# EAGLE design m1-output-reg (EAGLE 9.6.1)
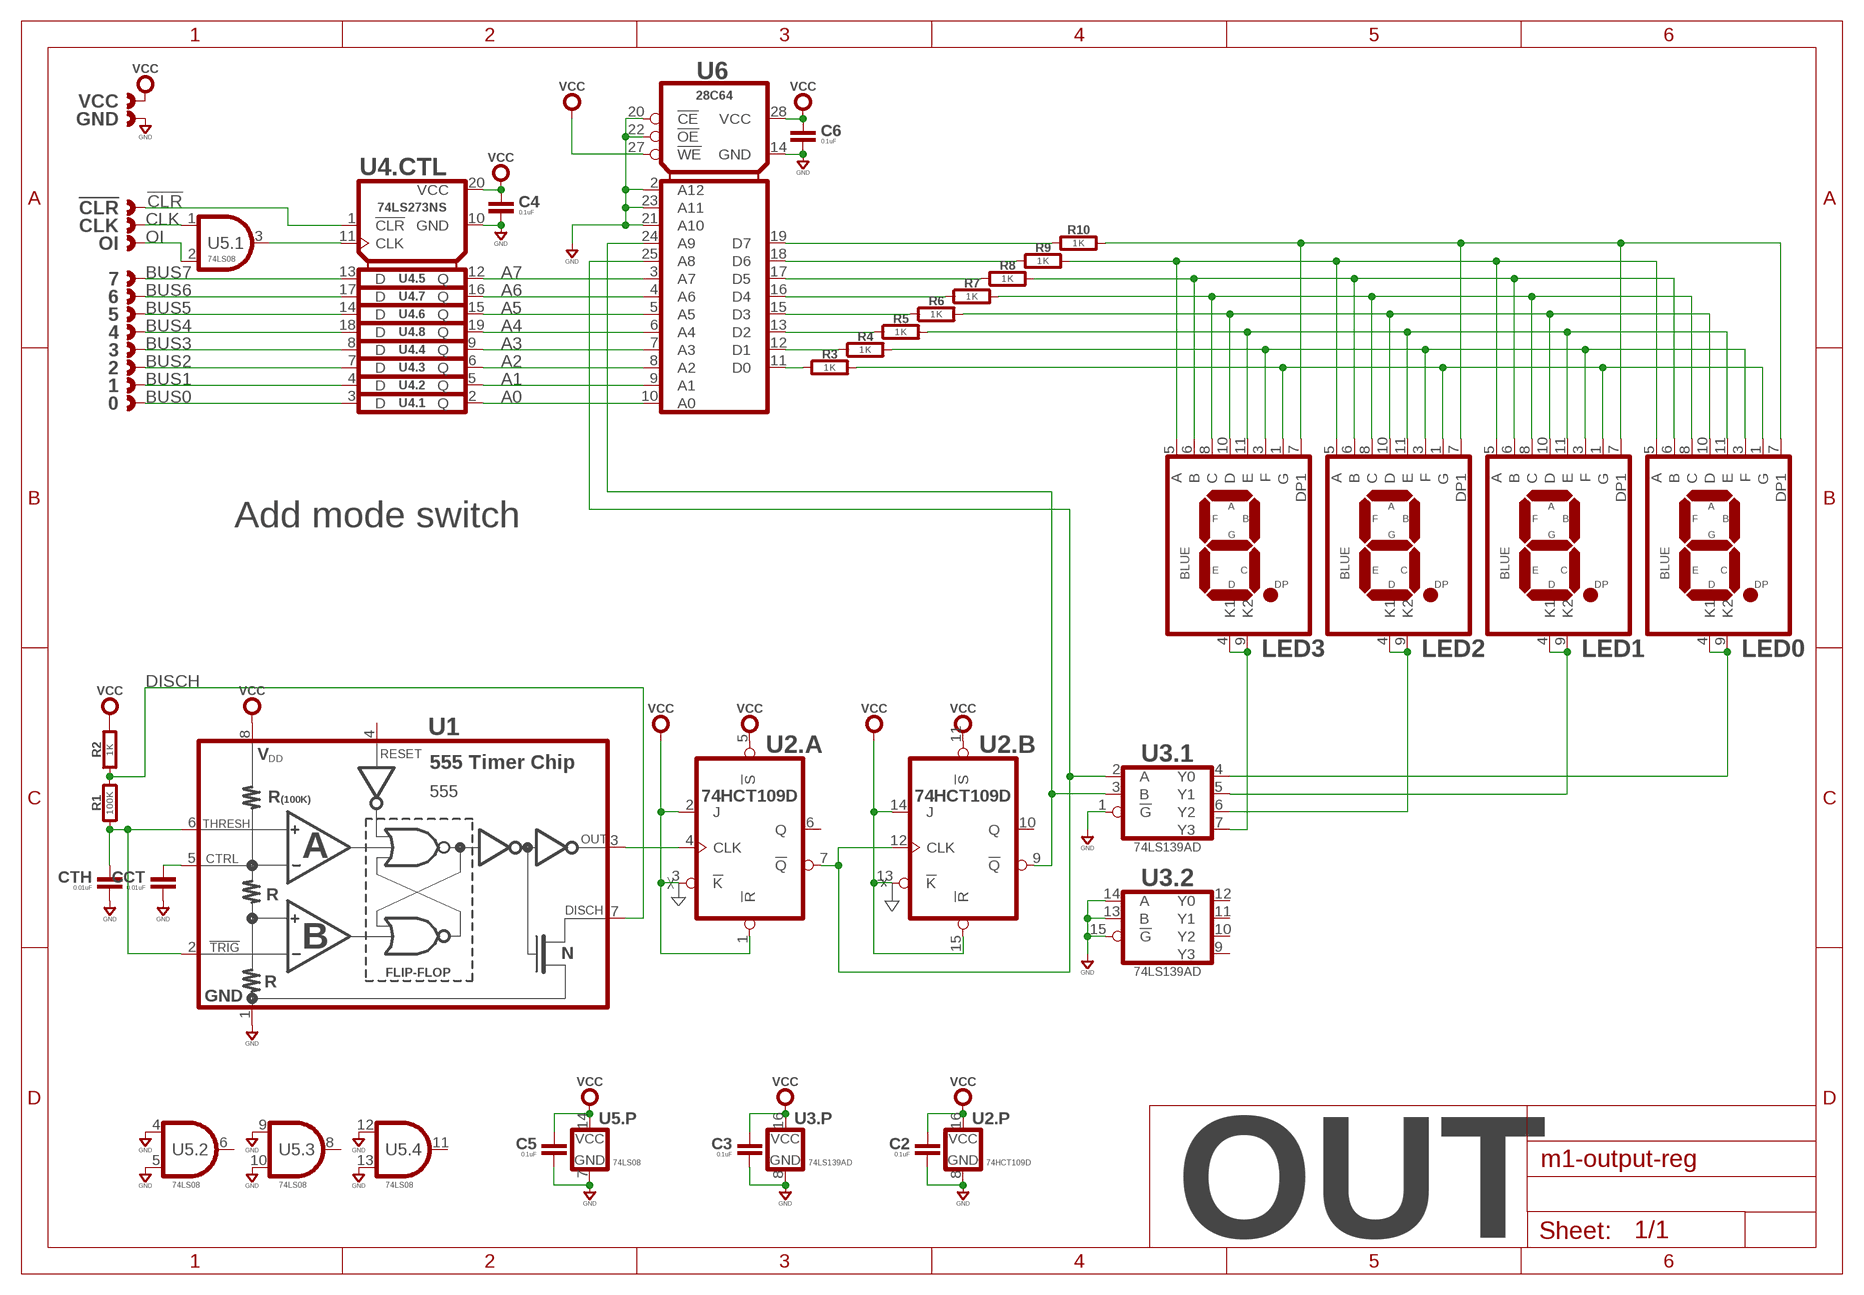
[diagram p0: schematic, sheet 1]

## Parts
0  CAST-01X1  [CAST01-2.54MM]
1  CAST-01X1  [CAST01-2.54MM]
2  CAST-01X1  [CAST01-2.54MM]
3  CAST-01X1  [CAST01-2.54MM]
4  CAST-01X1  [CAST01-2.54MM]
5  CAST-01X1  [CAST01-2.54MM]
6  CAST-01X1  [CAST01-2.54MM]
7  CAST-01X1  [CAST01-2.54MM]
!CLR  CAST-01X1  [CAST01-2.54MM]
C2  0.1uF  CAPACITOR0603  [0603-CAP]
C3  0.1uF  CAPACITOR0603  [0603-CAP]
C4  0.1uF  CAPACITOR0603  [0603-CAP]
C5  0.1uF  CAPACITOR0603  [0603-CAP]
C6  0.1uF  CAPACITOR0603  [0603-CAP]
CCT  0.01uF  CAPACITOR0603  [0603-CAP]
CLK  CAST-01X1  [CAST01-2.54MM]
CTH  0.01uF  CAPACITOR0603  [0603-CAP]
GND  CAST-01X1  [CAST01-2.54MM]
LED0  BLUE  SEVEN_SEG_DISP_DP028-BLUE  [AVAGO-HDSM-281B-7SEG]
LED1  BLUE  SEVEN_SEG_DISP_DP028-BLUE  [AVAGO-HDSM-281B-7SEG]
LED2  BLUE  SEVEN_SEG_DISP_DP028-BLUE  [AVAGO-HDSM-281B-7SEG]
LED3  BLUE  SEVEN_SEG_DISP_DP028-BLUE  [AVAGO-HDSM-281B-7SEG]
OI  CAST-01X1  [CAST01-2.54MM]
R1  100K  RESISTOR0603  [0603-RES]
R2  1K  RESISTOR0603  [0603-RES]
R3  1K  RESISTOR0603  [0603-RES]
R4  1K  RESISTOR0603  [0603-RES]
R5  1K  RESISTOR0603  [0603-RES]
R6  1K  RESISTOR0603  [0603-RES]
R7  1K  RESISTOR0603  [0603-RES]
R8  1K  RESISTOR0603  [0603-RES]
R9  1K  RESISTOR0603  [0603-RES]
R10  1K  RESISTOR0603  [0603-RES]
U1  555  555SOIC  [SOP08]
U2  74HCT109D  74AHCT109D  [SO16]
U3  74LS139AD  74LS139D  [SO16]
U4  74LS273NS  [SO20]
U5  74LS08  74LS08D  [SOP14]
U6  28C64  28C64S  [SO28]
VCC  CAST-01X1  [CAST01-2.54MM]

## Nets
!CLR: !CLR.1 U4.1(.CTL:!CLR)
A0: U4.2(.1:Q) U6.10(A0)
A1: U4.5(.2:Q) U6.9(A1)
A2: U4.6(.3:Q) U6.8(A2)
A3: U4.9(.4:Q) U6.7(A3)
A4: U4.19(.8:Q) U6.6(A4)
A5: U4.15(.6:Q) U6.5(A5)
A6: U4.16(.7:Q) U6.4(A6)
A7: U4.12(.5:Q) U6.3(A7)
BUS0: 0.1 U4.3(.1:D)
BUS1: 1.1 U4.4(.2:D)
BUS2: 2.1 U4.7(.3:D)
BUS3: 3.1 U4.8(.4:D)
BUS4: 4.1 U4.18(.8:D)
BUS5: 5.1 U4.14(.6:D)
BUS6: 6.1 U4.17(.7:D)
BUS7: 7.1 U4.13(.5:D)
CLK: CLK.1 U5.1(.1:A)
DISCH: R1.1 R2.1 U1.7(DISCHARGE)
GND: C2.2 C3.2 C4.2 C5.2 C6.2 CCT.2 CTH.2 GND.1 U1.1(GND) U2.8(.P:GND) U3.1(.1:!G) U3.8(.P:GND) U3.13(.2:B) U3.14(.2:A) U3.15(.2:!G) U4.10(.CTL:GND) U5.4(.2:A) U5.5(.2:B) U5.7(.P:GND) U5.9(.3:A) U5.10(.3:B) U5.12(.4:A) U5.13(.4:B) U6.2(A12) U6.14(GND) U6.20(!CE) U6.21(A10) U6.22(!OE) U6.23(A11)
N$1: CTH.1 R1.2 U1.2(TRIGGER#) U1.6(THRESHOLD)
N$2: CCT.1 U1.5(CONTROL)
N$4: U1.3(OUTPUT) U2.4(.A:CLK)
N$5: U2.9(.B:!Q) U3.3(.1:B) U6.24(A9)
N$6: U2.7(.A:!Q) U2.12(.B:CLK) U3.2(.1:A) U6.25(A8)
N$10: U4.11(.CTL:CLK) U5.3(.1:Y)
N$27: R3.1 U6.11(D0)
N$28: R4.1 U6.12(D1)
N$29: R5.1 U6.13(D2)
N$30: R6.1 U6.15(D3)
N$31: R7.1 U6.16(D4)
N$32: R8.1 U6.17(D5)
N$33: R9.1 U6.18(D6)
N$34: R10.1 U6.19(D7)
N$35: LED0.7(DP1) LED1.7(DP1) LED2.7(DP1) LED3.7(DP1) R10.2
N$36: LED0.5(A) LED1.5(A) LED2.5(A) LED3.5(A) R9.2
N$37: LED0.6(B) LED1.6(B) LED2.6(B) LED3.6(B) R8.2
N$38: LED0.4(K1) LED0.9(K2) U3.4(.1:Y0)
N$39: LED0.8(C) LED1.8(C) LED2.8(C) LED3.8(C) R7.2
N$40: LED0.10(D) LED1.10(D) LED2.10(D) LED3.10(D) R6.2
N$41: LED0.11(E) LED1.11(E) LED2.11(E) LED3.11(E) R5.2
N$42: LED0.3(F) LED1.3(F) LED2.3(F) LED3.3(F) R4.2
N$43: LED0.1(G) LED1.1(G) LED2.1(G) LED3.1(G) R3.2
N$44: LED3.4(K1) LED3.9(K2) U3.7(.1:Y3)
N$45: LED2.4(K1) LED2.9(K2) U3.6(.1:Y2)
N$46: LED1.4(K1) LED1.9(K2) U3.5(.1:Y1)
OI: OI.1 U5.2(.1:B)
VCC: C2.1 C3.1 C4.1 C5.1 C6.1 R2.2 U1.8(VDD) U2.1(.A:!R) U2.2(.A:J) U2.3(.A:!K) U2.5(.A:!S) U2.11(.B:!S) U2.13(.B:!K) U2.14(.B:J) U2.15(.B:!R) U2.16(.P:VCC) U3.16(.P:VCC) U4.20(.CTL:VCC) U5.14(.P:VCC) U6.27(!WE) U6.28(VCC) VCC.1
Unconnected: U1.4(RESET#) U2.6(.A:Q) U2.10(.B:Q) U3.9(.2:Y3) U3.10(.2:Y2) U3.11(.2:Y1) U3.12(.2:Y0) U5.6(.2:Y) U5.8(.3:Y) U5.11(.4:Y)

## Notes on the sheet
- Add mode switch
- OUT

## Library data of the parts
0 1-7 !CLR CLK GND OI VCC = con-headers:CAST-01X1: Castelated Edge Hole Pad
C2-C6 CCT CTH = rlc:CAPACITOR: Capacitor
LED0 LED1-LED3 = led:SEVEN_SEG_DISP_DP: Seven Segment LED Display; MFR: Avago; MPN: HDSM-283B
R1-R10 = rlc:RESISTOR: Resistor
U1 = logic:555: Timer Chip; MFR: TI; MPN: NE555PSR
U2 = logic:74*109?: Dual J-K Flip Flop Pos. Edge; MPN: 74HCT109D
U3 = logic:74*139?: Dual 2-line to 4-line Decoder/Demux; MPN: 74LS139AD
U4 = logic:74*273?: Octal D-type Flip Flop; MPN: 74LS273NS
U5 = logic:74*08?: Quad AND Gate; MPN: 74LS08D
U6 = logic:28*64?: EEPROM 8K x 8; MFR: Microchip; MPN: AT28C64B-15SU

## Board
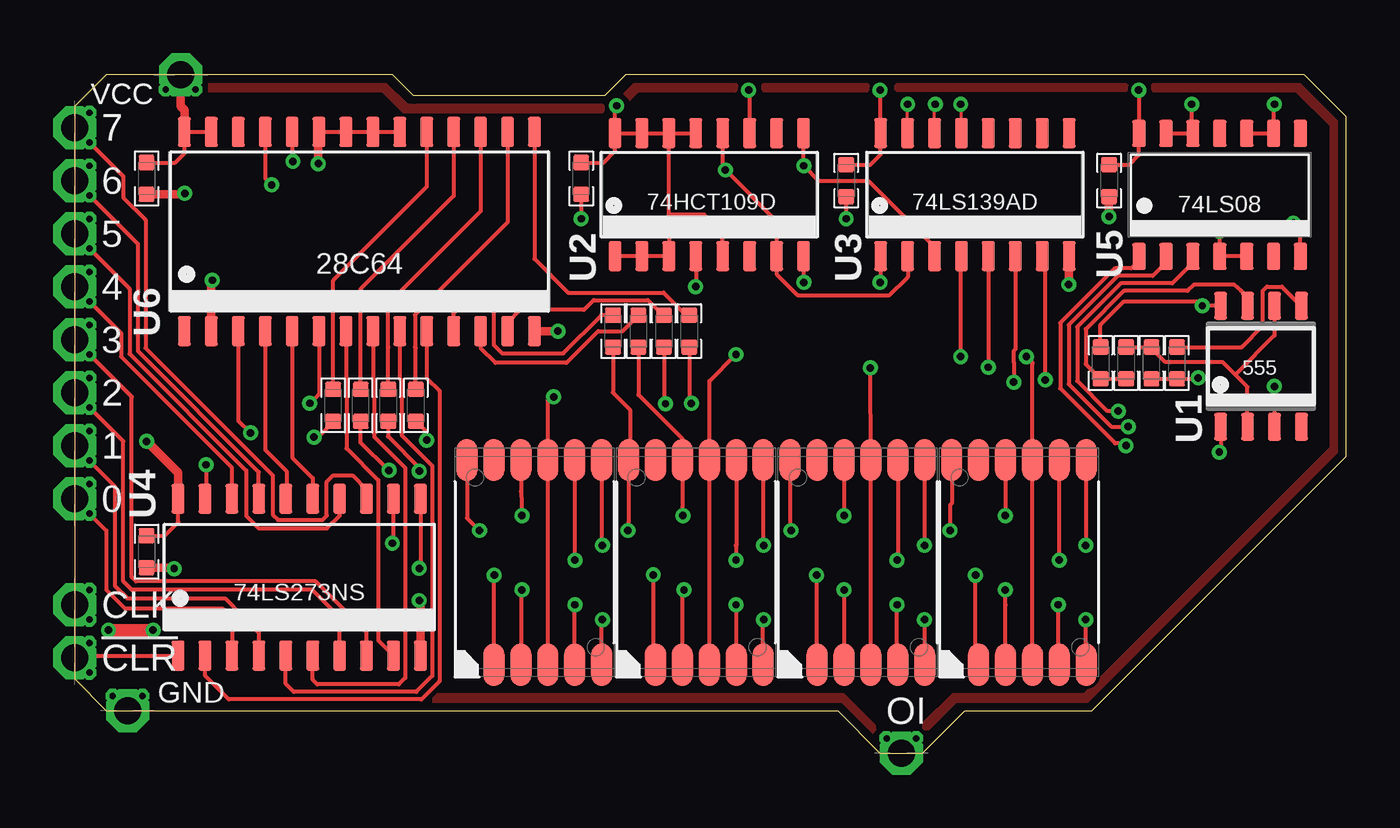
[diagram p1: board, top side]
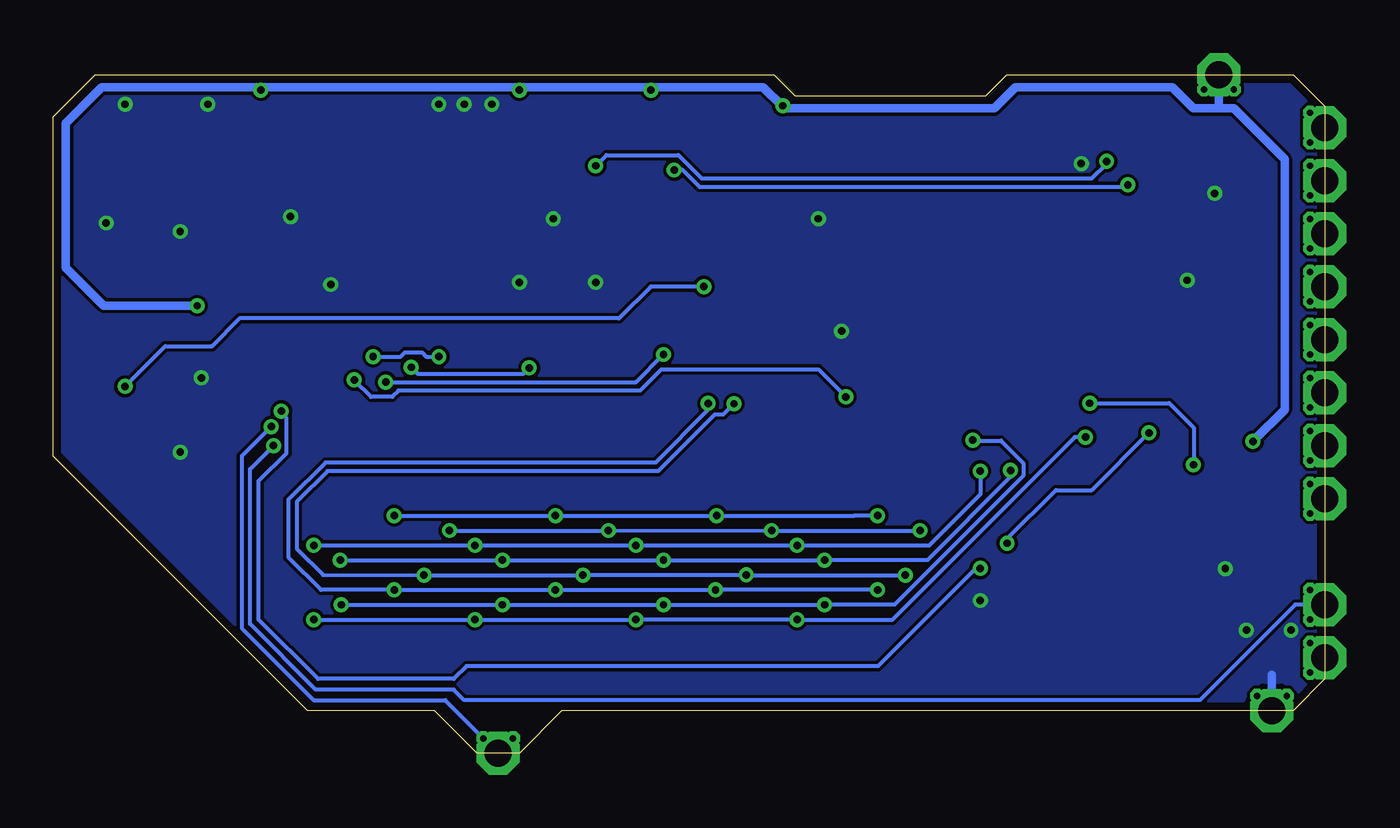
[diagram p2: board, bottom side, seen from below]

Size 60 x 32 mm. Coordinates in mm from the lower left corner, seen from the top.
Outline: 1.5,2 36,2 38,0 40,0 42,2 48,2 60,14 60,30 58,32 26,32 25,31 16,31 15,32 1.5,32 0,30.5 0,3.5 1.5,2
Copper layers (1*16): Top 0.0356mm / dielectric 1.5011mm / Bottom 0.0356mm
Design rules "OSH-CircuitMonkey *": minimum track width 6mil, minimum drill 12mil, track to track 6mil, track to pad 6mil, pad to pad 6mil, via to via 6mil, smd to smd 6mil, copper to edge 15mil, drill to drill 6mil, minimum pad ring 7mil, minimum via ring 7mil, stop-mask expansion 3mil, vias tented up to drill 14mil, thermal gap 10mil

### Footprints (pad centres in the part's own frame; a part is rotated, then mirrored left to right if it is on the bottom)
CAST01-2.54MM = drill 1.27 pad 2.032 octagon: 1 0,0 | drill 0.305 octagon: P$1 -0.7,0.7; P$2 -0.7,-0.7
0603-CAP = smd 0.711 x 0.762: 1 -0.752,0; 2 0.752,0
AVAGO-HDSM-281B-7SEG = smd 1 x 2: 1 -3.175,4.826; 2 -1.905,4.826; 3 -0.635,4.826; 4 0.635,4.826; 5 1.905,4.826; 6 3.175,4.826; 7 3.175,-4.826; 8 1.905,-4.826; 9 0.635,-4.826; 10 -0.635,-4.826; 11 -1.905,-4.826
0603-RES = smd 0.711 x 0.762: 1 -0.752,0; 2 0.752,0
SOP08 = smd 0.6 x 1.3: 1 -1.905,-2.85; 2 -0.635,-2.85; 3 0.635,-2.85; 4 1.905,-2.85; 5 1.905,2.85; 6 0.635,2.85; 7 -0.635,2.85; 8 -1.905,2.85
SO16 = smd 0.6 x 1.4: 1 -4.445,-2.9; 2 -3.175,-2.9; 3 -1.905,-2.9; 4 -0.635,-2.9; 5 0.635,-2.9; 6 1.905,-2.9; 7 3.175,-2.9; 8 4.445,-2.9; 9 4.445,2.9; 10 3.175,2.9; 11 1.905,2.9; 12 0.635,2.9; 13 -0.635,2.9; 14 -1.905,2.9; 15 -3.175,2.9; 16 -4.445,2.9
SO20 = smd 0.6 x 1.4: 1 -5.715,-3.7; 2 -4.445,-3.7; 3 -3.175,-3.7; 4 -1.905,-3.7; 5 -0.635,-3.7; 6 0.635,-3.7; 7 1.905,-3.7; 8 3.175,-3.7; 9 4.445,-3.7; 10 5.715,-3.7; 11 5.715,3.7; 12 4.445,3.7; 13 3.175,3.7; 14 1.905,3.7; 15 0.635,3.7; 16 -0.635,3.7; 17 -1.905,3.7; 18 -3.175,3.7; 19 -4.445,3.7; 20 -5.715,3.7
SOP14 = smd 1.27 x 0.635: 1 -2.9,3.81; 2 -2.9,2.54; 3 -2.9,1.27; 4 -2.9,0; 5 -2.9,-1.27; 6 -2.9,-2.54; 7 -2.9,-3.81; 8 2.9,-3.81; 9 2.9,-2.54; 10 2.9,-1.27; 11 2.9,0; 12 2.9,1.27; 13 2.9,2.54; 14 2.9,3.81
SO28 = smd 0.6 x 1.4: 1 -8.255,-4.7; 2 -6.985,-4.7; 3 -5.715,-4.7; 4 -4.445,-4.7; 5 -3.175,-4.7; 6 -1.905,-4.7; 7 -0.635,-4.7; 8 0.635,-4.7; 9 1.905,-4.7; 10 3.175,-4.7; 11 4.445,-4.7; 12 5.715,-4.7; 13 6.985,-4.7; 14 8.255,-4.7; 15 8.255,4.7; 16 6.985,4.7; 17 5.715,4.7; 18 4.445,4.7; 19 3.175,4.7; 20 1.905,4.7; 21 0.635,4.7; 22 -0.635,4.7; 23 -1.905,4.7; 24 -3.175,4.7; 25 -4.445,4.7; 26 -5.715,4.7; 27 -6.985,4.7; 28 -8.255,4.7

### Placement (x,y rotation side)
0  0,12 180 top
1  0,14.5 180 top
2  0,17 180 top
3  0,19.5 180 top
4  0,22 180 top
5  0,24.5 180 top
6  0,27 180 top
7  0,29.5 180 top
!CLR  0,4.5 180 top
C2  23.9,27.1 270 top
C3  36.4,27 270 top
C4  3.4,9.5 270 top
C5  48.8,27 270 top
C6  3.4,27.1 270 top
CCT  52,18.4 270 top
CLK  0,7 180 top
CTH  50.8,18.4 270 top
GND  2.5,2 270 top
LED0  44.55,9 0 top
LED1  36.93,9 0 top
LED2  29.31,9 0 top
LED3  21.69,9 0 top
OI  39,0 270 top
R1  49.6,18.4 90 top
R2  48.4,18.4 90 top
R3  25.4,19.9 270 top
R4  26.6,19.9 270 top
R5  27.8,19.9 270 top
R6  29,19.9 270 top
R7  16.1,16.4 270 top
R8  14.8,16.4 270 top
R9  13.5,16.4 270 top
R10  12.2,16.4 270 top
U1  55.97,18.25 0 top
U2  29.94,26.34 0 top
U3  42.47,26.34 0 top
U4  10.6,8.3 0 top
U5  54.02,26.33 90 top
U6  13.44,24.6 0 top
VCC  5,32 90 top

### Tracks (layer width: path | path; a pad name or v marks a point on that pad's centre or on a via)
!CLR
  Top 0.2: !CLR.1 0.1,4.6 U4.1
A0
  Top 0.2: U6.10 16.61,17.69 17.22,17.08 17.22,3.4 16.36,2.54 7.28,2.54 6.17,3.65 6.17,4.58 U4.2
A1
  Top 0.2: U6.9 15.35,17.66 15.43,17.57 15.43,14.99 16.87,13.55 16.87,3.65 16.11,2.9 10.34,2.9 9.96,3.27 U4.5
A2
  Top 0.2: U6.8 14.07,17.63 14.13,17.57 14.13,14.92 15.6,13.45 15.6,3.55 15.3,3.25 11.45,3.25 11.23,3.47 U4.6
A3
  Top 0.2: U6.7 12.8,17.6 12.83,17.57 12.83,14.37 14.33,12.88 14.33,5.32 U4.9
A4  (via drill 0.35)
  Top 0.2: U6.6 11.54,16.93 v11.1,16.5 | v6.2,13.6 6.2,12.04 U4.19
  Bottom 0.2: v6.2,13.6 v6.2,13.61 6.2,15.35 7.35,16.5 v11.1,16.5
A5
  Top 0.2: U6.5 10.27,13.94 11.23,12.96 U4.15
A6
  Top 0.2: U6.4 8.99,14.3 10,13.3 10,12.04 U4.16
A7  (via drill 0.35)
  Top 0.2: U6.3 7.72,15.68 v8.3,15.1 | v14.99,9.9 15.04,9.9 U4.12
  Bottom 0.2: v8.3,15.1 11,12.4 12.69,12.4 14.99,10.1 v14.99,9.9
AAA
  pour Top: 6.3,31.6 6.3,31.2 14.5,31.2 15.5,30.2 24.9,30.2 25,30.3 25,30.5 24.9,30.6 15.7,30.6 14.7,31.6
BBB
  pour Top: 25.9,31.1 26.2,30.8 26.6,31.2 31.2,31.2 31.3,31.3 31.3,31.5 31.2,31.6 26.4,31.6
BUS0
  Top 0.2: 0.1 1.5,10.5 1.5,7.7 2.4,6.8 7,6.8 7.42,6.38 U4.3
BUS1
  Top 0.2: 1.1 0,14.48 1.9,12.58 1.9,7.9 2.5,7.3 7.1,7.3 8.7,5.68 U4.4
BUS2
  Top 0.2: U4.7 12.51,6.4 11.21,7.7 2.7,7.7 2.3,8.1 2.3,14.7 2.1
BUS3
  Top 0.2: U4.8 13.78,5.7 11.38,8.1 2.9,8.1 2.7,8.3 2.7,16.8 3.1
BUS4
  Top 0.2: 4.1 2.2,19.8 2.2,18.7 7.41,13.49 7.41,12.02 U4.18
BUS5
  Top 0.2: 5.1 2.6,21.9 2.6,18.83 8.1,13.33 8.1,11.19 8.69,10.6 11.9,10.6 12.51,11.21 U4.14
BUS6
  Top 0.2: 6.1 3,24 3,18.95 8.7,13.26 U4.17
BUS7
  Top 0.2: 7.1 2.3,27.2 2.3,26.2 3.35,25.15 3.35,19.1 9.35,13.11 9.35,11.25 9.6,11 11.7,11 11.9,11.2 11.9,12.8 12.2,13.1 13.11,13.1 13.76,12.45 13.76,12.02 U4.13
CCC
  pour Top: 32.5,31.6 32.4,31.5 32.4,31.3 32.5,31.2 37.4,31.2 37.5,31.3 37.5,31.5 37.4,31.6
CLK  (via drill 0.35)
  Top 0.2: U5.1 50.21,23.23 49.84,22.86 49.06,22.86 46.49,20.29 46.49,17.2 49.09,14.61 49.49,14.61 v49.59,14.5
  Bottom 0.2: CLK.1 1.4,7 5.9,2.5 40.6,2.5 41.1,3 47.6,3 50.7,6.1 50.7,13.39 v49.59,14.5
DDD
  pour Top: 38.8,31.2 38.7,31.3 38.7,31.5 38.8,31.6 49.6,31.6 49.7,31.5 49.7,31.3 49.6,31.2
DISCH
  Top 0.2: U1.7 55.33,21.5 55.03,21.8 54.7,22.1 52.8,22.1 52.5,21.8 49.5,21.8 47.7,20 47.7,18.35 R2.1 R1.1
FFF
  pour Top: 50.9,31.6 50.8,31.5 50.8,31.3 50.9,31.2 57.6,31.2 59.2,29.6 59.2,14.4 47.6,2.8 41.4,2.8 40,1.4 40,1.2 40.1,1.1 40.3,1.1 41.6,2.4 47.8,2.4 59.6,14.2 59.6,29.8 57.8,31.6
GGG
  pour Top: 37.65,0.95 37.8,1.1 37.8,1.3 36.3,2.8 17.1,2.8 16.9,2.6 16.9,2.4 36.2,2.4
GND  (via drill 0.35)
  Top 0.152: U3.15 v39.3,30.59 v39.3,30.6 | U3.14 40.56,30.57 v40.6,30.6 | U3.13 41.84,30.57 v41.8,30.6
  Top 0.2: U6.23 U6.22 U6.21 U6.20 | U3.1 38.02,22.23 v38,22.2 | C3.2 v36.4,25.2 | U2.8 34.38,22.21 v34.4,22.2 | U5.7 57.83,24.67 v57.5,25 | v54,24.6 54.02,24.58 U5.4 U5.5 | v56.6,30.6 56.56,30.56 U5.9 U5.10 | U5.12 52.74,29.24 | 52.74,29.24 52.7,29.28 v52.7,30.6 | U5.13 52.73,29.23 52.74,29.24 | C2.2 v23.9,25.2 | CTH.2 CCT.2 52.95,17.65 v53,17.7 | U1.1 54.06,14.26 v54,14.2
  Top 0.4: C6.2 5.15,26.35 v5.2,26.4 | U6.23 11.5,29.27 v11.5,27.8 | U6.14 v22.8,19.9 | U6.2 6.46,22.25 v6.5,22.3 | C4.2 4.65,8.75 v4.7,8.7 v4.7,8.71 | U4.10 16.32,7.18 16.3,7.2 v16.26,7.2 | C5.2 v48.8,25.3 | U3.8 46.91,22.11 v46.9,22.1
  Top 0.6: v1.6,5.8 v3.7,5.8
  Bottom 0.4: GND.1 2.5,3.7
  pour Bottom: 0,30.5 1.5,32 15,32 16,31 25,31 26,32 58,32 60,30 60,14 48,2 42,2 40,0 38,0 36,2 1.5,2 0,3.5
N$1
  Top 0.2: U1.2 55.33,17.27 54.75,17.85 | 54.75,17.85 54.16,18.44 51.46,18.44 50.8,19.1 CTH.1 R1.2 | U1.6 56.6,19.7 54.75,17.85
N$2
  Top 0.2: CCT.1 55.05,19.15 56.05,20.15 56.05,21.8 56.25,22 56.95,22 57.85,21.1 U1.5
N$4  (via drill 0.35)
  Top 0.2: U2.4 v29.3,22 | v56.6,17.3 U1.3
  Bottom 0.2: v29.3,22 31.8,22 33.3,20.5 51.2,20.5 52.5,19.2 54.7,19.2 v56.6,17.3
N$5  (via drill 0.35)
  Top 0.2: U6.24 10.27,27.93 v10.3,27.9 v10.3,27.91 | U2.9 34.38,27.71 v34.4,27.7 35.1,27 35.1,26.99 37.45,26.99 40.56,23.87 U3.3
  Bottom 0.2: v10.3,27.91 10.3,27.8 11,27.11 29.41,27.11 30.5,28.2 33.9,28.2 v34.4,27.7
N$6  (via drill 0.35)
  Top 0.2: U2.12 30.57,27.62 v30.7,27.5 33.12,25.09 U2.7 33.12,22.59 34.1,21.59 38.45,21.59 39.3,22.45 U3.2 | U6.25 8.99,27.11 v9.3,26.8
  Bottom 0.2: v9.3,26.8 9.4,26.7 29.5,26.7 30.3,27.5 v30.7,27.5
N$10  (via drill 0.35)
  Top 0.2: U4.11 16.32,8.71 v16.26,8.71 | U5.3 52.75,23.13 51.77,22.15 49.35,22.15 47.3,20.1 47.3,17.56 48.73,16.13 v49.23,16.13
  Bottom 0.2: v16.26,8.71 16.46,8.71 21.08,4.1 40.5,4.1 41.1,3.5 47.5,3.5 50.3,6.3 50.3,12.84 48.99,14.15 48.99,15.79 49.23,16.03 v49.23,16.13
N$27
  Top 0.2: R3.1 24.85,20.65 23.05,18.85 20.17,18.85 19.77,19.25 19.77,20.79 19.51,21.05 18.2,21.05 17.89,20.73 U6.11
N$28
  Top 0.2: R4.1 25.85,19.9 24.7,19.9 23.2,18.4 19.86,18.4 19.16,19.1 U6.12
N$29
  Top 0.2: R5.1 27.75,20.65 27.04,21.36 24.48,21.36 24.02,20.9 21.02,20.9 20.43,20.3 U6.13
N$30
  Top 0.2: U6.15 21.7,23.3 23.29,21.71 27.79,21.71 28.85,20.65 R6.1
N$31
  Top 0.2: R7.1 16.1,19.11 16.06,19.15 16.06,20.66 20.43,25.02 U6.16
N$32
  Top 0.2: R8.1 14.8,19.14 14.79,19.15 14.79,21.19 19.16,25.55 U6.17
N$33
  Top 0.2: R9.1 13.5,21.9 17.89,26.29 U6.18
N$34
  Top 0.2: R10.1 12.2,22.3 16.61,26.71 U6.19
N$35  (via drill 0.35)
  Top 0.2: R10.2 12.2,15.6 11.5,14.9 v11.3,14.9 | LED1.7 v40.1,6.29 v40.1,6.3 | LED0.7 47.7,4.2 v47.7,6.3 | LED2.7 32.48,6.29 v32.5,6.3 | LED3.7 24.86,6.26 v24.9,6.3
  Bottom 0.2: v11.3,14.9 11.8,14.9 20.4,6.3 v24.9,6.3 v32.5,6.3 v40.1,6.3 v47.7,6.3
N$36  (via drill 0.35)
  Top 0.2: R9.2 13.48,15.63 13.48,14.67 v14.82,13.33 v14.83,13.33 | v23.6,9.1 v23.59,9.11 LED3.5 | LED2.5 31.21,9.81 31.2,9.8 v31.2,9.1 | LED1.5 38.84,9.44 v38.8,9.1 | v46.45,9.1 LED0.5
  Bottom 0.2: v14.83,13.33 14.83,13.03 18.76,9.1 v23.6,9.1 | v23.6,9.1 v31.2,9.1 v38.8,9.1 v46.45,9.1 | v23.6,9.1
N$37  (via drill 0.35)
  Top 0.2: R8.2 14.78,15.63 14.78,14.94 16.3,13.42 16.3,13.3 v16.26,13.3 | LED3.6 24.86,9.93 v24.9,9.8 | LED2.6 32.48,10.31 v32.5,9.8 | LED1.6 v40.1,9.8 | LED0.6 47.7,13.8 v47.7,9.8
  Bottom 0.2: v16.26,13.3 16.26,12.2 18.66,9.8 v24.9,9.8 v32.5,9.8 40,9.8 v40.1,9.8 40.15,9.8 v47.7,9.8
N$38  (via drill 0.35)
  Top 0.2: v44.9,18.7 45.2,18.4 45.19,18.39 LED0.4 LED0.9 | v41.8,18.7 41.8,23.41 U3.4
  Bottom 0.2: v41.8,18.7 42.4,18.7 42.6,18.9 43.4,18.9 43.6,18.7 v44.9,18.7
N$39  (via drill 0.35)
  Top 0.2: LED3.8 v23.59,7 v23.6,7 | v31.2,7 31.2,4.19 LED2.8 | LED1.8 38.8,4.21 v38.8,7 | LED0.8 46.4,4.23 v46.4,7 | R7.2 16.13,15.65 16.61,15.16 v16.61,14.76
  Bottom 0.2: v46.4,7 v38.8,7 v31.2,7 v23.6,7 20.31,7 14.23,13.08 14.23,13.68 15.28,14.74 16.59,14.74 v16.61,14.76
N$40  (via drill 0.35)
  Top 0.2: LED0.10 43.91,6.99 43.9,6.99 v43.9,7.7 | v36.3,7.7 LED1.10 | LED2.10 28.68,7.67 28.7,7.7 v28.75,7.7 | v21.1,7.7 21.05,7.66 LED3.10 | R6.2 29,16.6 v29.1,16.5
  Bottom 0.2: v21.1,7.7 v28.75,7.7 v36.3,7.7 v43.9,7.7 47.36,7.7 48.91,9.25 48.91,11.95 47.15,13.71 31.59,13.71 29.1,16.2 v29.1,16.5
N$41  (via drill 0.35)
  Top 0.2: LED0.11 42.5,4.32 v42.5,8.4 | v35,8.4 35,4.2 LED1.11 | LED2.11 27.3,4.28 v27.3,8.4 | LED3.11 19.79,8.38 v19.8,8.4 | R5.2 27.8,16.6 27.88,16.52 v27.88,16.48
  Bottom 0.2: v19.8,8.4 v27.3,8.4 34.95,8.4 v35,8.4 v42.5,8.4 47.26,8.4 48.51,9.65 48.51,11.85 47.05,13.3 31.45,13.3 28.78,15.98 28.38,15.98 v27.88,16.48
N$42  (via drill 0.35)
  Top 0.2: LED3.3 21.05,12.35 v21.1,11.2 | R4.2 26.6,16.9 28.68,14.82 LED2.3 28.68,11.61 v28.7,11.2 | LED1.3 v36.3,11.2 | LED0.3 43.91,11.52 v43.9,11.2
  Bottom 0.2: v21.1,11.2 22.2,11.2 v28.7,11.2 v36.3,11.2 v43.9,11.2
N$43  (via drill 0.35)
  Top 0.2: LED3.1 18.52,11.09 v19.1,10.5 | R3.2 25.4,17 26.2,16.2 26.2,13.89 LED2.1 26.14,10.89 v26.1,10.5 | LED1.1 33.76,10.9 v33.8,10.5 | LED0.1 41.38,11.78 41.3,11.7 v41.3,10.5
  Bottom 0.2: v19.1,10.5 v26.1,10.5 v26.11,10.51 v33.8,10.5 v41.3,10.5
N$44  (via drill 0.35)
  Top 0.2: v22.6,16.8 22.5,16.8 22.32,16.62 LED3.4 LED3.9 | v45.79,17.6 45.79,23.3 U3.7
  Bottom 0.2: v22.6,16.8 23.9,18.1 31.3,18.1 32.3,17.1 43.7,17.1 44,16.8 45,16.8 v45.79,17.59 v45.79,17.6
N$45  (via drill 0.35)
  Top 0.2: v31.2,18.8 29.95,17.55 29.95,14 LED2.4 LED2.9 | U3.6 44.38,19.03 44.3,18.95 44.3,18.45 44.3,18.44 v44.3,17.5
  Bottom 0.2: v44.3,17.5 32.5,17.5 v31.2,18.8
N$46  (via drill 0.35)
  Top 0.2: v37.53,18.16 LED1.4 LED1.9 | U3.5 v43.1,18.2
  Bottom 0.2: v37.53,18.16 37.8,17.9 42.8,17.9 v43.1,18.2
OI  (via drill 0.35)
  Top 0.2: U5.2 51.48,23.13 50.86,22.5 49.21,22.5 46.9,20.2 46.9,17.4 48.9,15.4 v49.7,15.4
  Bottom 0.2: OI.1 41.5,2.5 47.7,2.5 51.1,5.9 51.1,14 v49.7,15.4
VCC  (via drill 0.35)
  Top 0.2: C4.1 4.25,10.25 4.9,10.9 4.9,11.98 U4.20 | C6.1 4.75,27.85 5.18,28.29 U6.28 U6.27 | v50.2,31.27 U5.14 50.21,28.21 49.75,27.75 C5.1 | C3.1 37.55,27.75 38.02,28.23 U3.16 38.02,31.27 38,31.3 v38,31.27 | U2.16 25.5,30.46 v25.57,30.53 | C2.1 24.95,27.85 25.5,28.4 U2.16 | U2.16 U2.15 U2.14 28.1,29.24 | 28.1,29.24 U2.13 | 28.04,25.4 U2.3 | 28.04,25.4 28.04,29.18 28.1,29.24 | U2.5 30.57,24.52 29.7,25.4 28.04,25.4 | v31.8,31.27 31.84,31.22 U2.11 | U2.3 U2.2 | U2.3 U2.1 | U1.8 v53.2,21.1 53,21.3 49.5,21.3 48.4,20.2 R2.2
  Top 0.4: U4.20 4.88,13.21 v3.4,14.7 | U6.28 5.18,30.32 5,30.5 VCC.1
  Bottom 0.4: v3.4,14.7 1.9,16.2 1.9,28 4.3,30.4 5,30.4 | 5,30.4 6.2,30.4 7.2,31.4 14.6,31.4 15.6,30.4 25.44,30.4 v25.57,30.53 25.6,30.5 26.5,31.4 31.67,31.4 v31.8,31.27 31.93,31.4 37.87,31.4 | VCC.1 5,30.4 | 37.87,31.4 v38,31.27 | 37.87,31.4 50.07,31.4 v50.2,31.27 50.33,31.4 57.7,31.4 59.4,29.7 59.4,22.9 59.2,22.7 57.6,21.1 v53.2,21.1